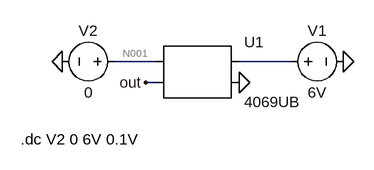
[diagram p0: schematic Ex1_q2.1.asc]
* Ex1_q2.1.asc
* U1: 4069UB (symbol AutoGenerated\4069UB not available, pins judged from their places): pin1=N001 pin2=out pin3=N002 pin4=0
V1 N002 0 6V
V2 N001 0 0
.dc V2 0 6V 0.1V
.backanno
.end

* Results of the author's LTspice run, read from the files saved beside the schematic
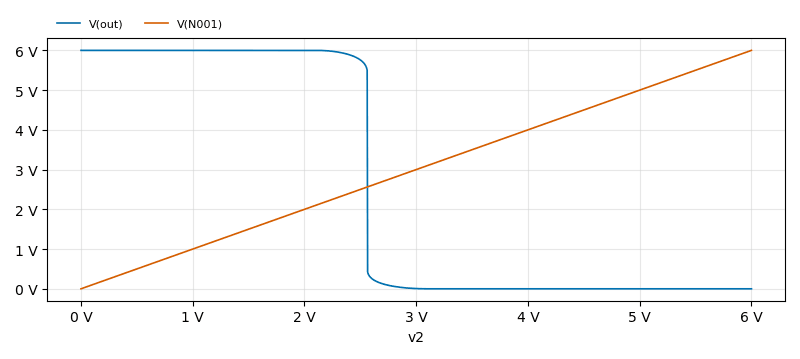
[diagram p1: DC transfer characteristic of Ex1_q2.1.asc, plotted from the saved traces]
* DC transfer characteristic, 1 run:
*   V(out): 6 V at v2=0 V, 3.522 nV at v2=6 V, min 3.522 nV, max 6 V
*   V(N001): 0 V at v2=0 V, 6 V at v2=6 V, min 0 V, max 6 V